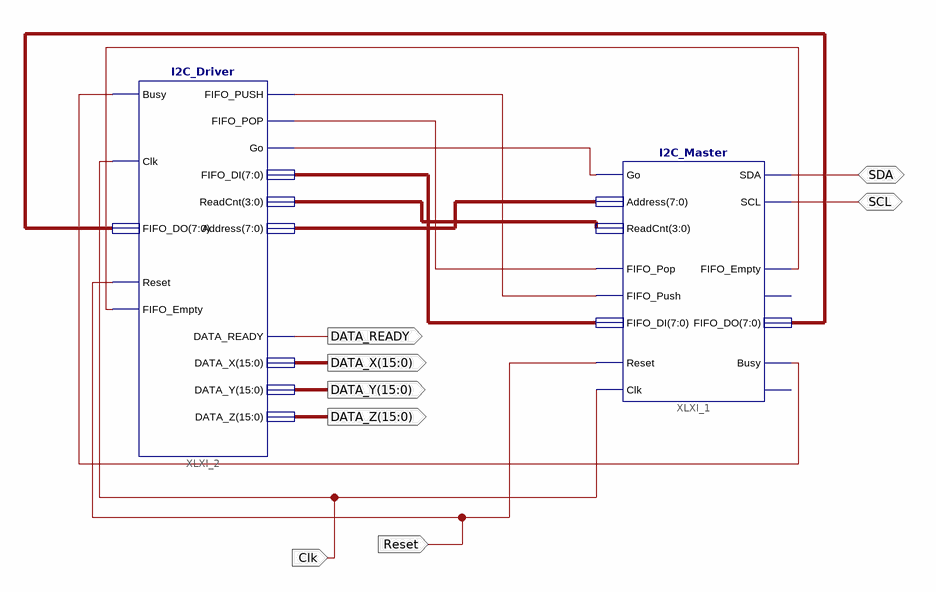
[diagram p0: schematic sheet 1]
// Xilinx ISE schematic main.sch (spartan3e) as structural Verilog: 2 symbols, 8 ports
module main (
  input  Clk,
  input  Reset,
  inout  SDA,
  inout  SCL,
  output DATA_READY,
  output [15:0] DATA_Y,
  output [15:0] DATA_Z,
  output [15:0] DATA_X
);

  wire XLXN_18, XLXN_19, XLXN_20, XLXN_24, XLXN_44;
  wire [3:0] XLXN_22;
  wire [7:0] XLXN_17, XLXN_21, XLXN_84;

  I2C_Master XLXI_1 (
    .Go(XLXN_18), .Address(XLXN_21), .ReadCnt(XLXN_22), .SDA(SDA), .SCL(SCL), .FIFO_Pop(XLXN_20),
    .FIFO_Push(XLXN_19), .FIFO_DI(XLXN_17), .FIFO_Empty(XLXN_44), .FIFO_DO(XLXN_84), .Reset(Reset),
    .Clk(Clk), .Busy(XLXN_24));  // open: FIFO_Full, NACK
  I2C_Driver XLXI_2 (
    .Busy(XLXN_24), .Clk(Clk), .Reset(Reset), .FIFO_Empty(XLXN_44), .FIFO_DO(XLXN_84), .FIFO_PUSH(XLXN_19),
    .FIFO_POP(XLXN_20), .DATA_READY(DATA_READY), .Go(XLXN_18), .FIFO_DI(XLXN_17), .ReadCnt(XLXN_22),
    .Address(XLXN_21), .DATA_X(DATA_X), .DATA_Y(DATA_Y), .DATA_Z(DATA_Z));
endmodule
